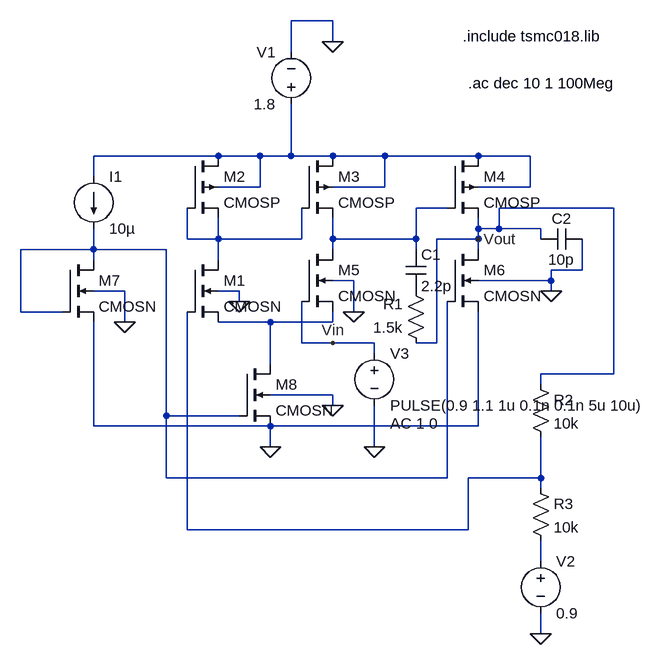
[diagram p0: schematic closed_loop_2-stage_ota.asc]
closed_loop_2-stage_ota.asc, the LTspice schematic file:
Version 4.1
SHEET 1 880 760
WIRE 288 -224 224 -224
WIRE 288 -192 288 -224
WIRE 224 -176 224 -224
WIRE 112 -16 -80 -16
WIRE 176 -16 112 -16
WIRE 224 -16 224 -96
WIRE 224 -16 176 -16
WIRE 288 -16 224 -16
WIRE 368 -16 288 -16
WIRE 512 -16 368 -16
WIRE 592 -16 512 -16
WIRE 288 0 288 -16
WIRE -80 16 -80 -16
WIRE 176 32 176 -16
WIRE 176 32 112 32
WIRE 368 32 368 -16
WIRE 368 32 288 32
WIRE 592 32 592 -16
WIRE 592 32 512 32
WIRE 464 64 416 64
WIRE 720 64 544 64
WIRE 512 96 512 80
WIRE 544 96 544 64
WIRE 544 96 512 96
WIRE 608 96 544 96
WIRE 64 112 64 64
WIRE 112 112 112 80
WIRE 112 112 64 112
WIRE 240 112 240 64
WIRE 240 112 112 112
WIRE 288 112 288 80
WIRE 416 112 416 64
WIRE 416 112 288 112
WIRE 512 112 512 96
WIRE 512 112 448 112
WIRE 608 112 608 96
WIRE -80 128 -80 96
WIRE -80 128 -192 128
WIRE 32 128 -80 128
WIRE 288 128 288 112
WIRE 416 128 416 112
WIRE 512 128 512 112
WIRE -80 144 -80 128
WIRE 112 144 112 112
WIRE 672 160 672 112
WIRE 672 160 624 160
WIRE 320 176 288 176
WIRE 624 176 624 160
WIRE 624 176 512 176
WIRE -32 192 -80 192
WIRE 144 192 112 192
WIRE 624 192 624 176
WIRE 144 208 144 192
WIRE -192 224 -192 128
WIRE -128 224 -192 224
WIRE 320 224 320 176
WIRE -32 240 -32 192
WIRE 192 240 112 240
WIRE 288 240 288 224
WIRE 288 240 192 240
WIRE 240 272 240 208
WIRE 288 272 240 272
WIRE 352 272 288 272
WIRE 448 272 448 112
WIRE 448 272 416 272
WIRE 352 288 352 272
WIRE 192 304 192 240
WIRE 720 320 720 64
WIRE 720 320 608 320
WIRE 608 336 608 320
WIRE 288 352 192 352
WIRE 288 368 288 352
WIRE 32 384 32 128
WIRE 144 384 32 384
WIRE -80 400 -80 240
WIRE 192 400 -80 400
WIRE 512 400 512 224
WIRE 512 400 192 400
WIRE 192 432 192 400
WIRE 352 432 352 368
WIRE 32 480 32 384
WIRE 464 480 464 208
WIRE 464 480 32 480
WIRE 608 480 608 416
WIRE 608 480 496 480
WIRE 608 496 608 480
WIRE 64 560 64 224
WIRE 496 560 496 480
WIRE 496 560 64 560
WIRE 608 608 608 576
WIRE 608 720 608 688
FLAG 192 432 0
FLAG -32 240 0
FLAG 288 368 0
FLAG 320 224 0
FLAG 144 208 0
FLAG 624 192 0
FLAG 288 -192 0
FLAG 512 112 Vout
FLAG 608 720 0
FLAG 352 432 0
FLAG 288 272 Vin
SYMBOL nmos4 64 144 R0
SYMATTR InstName M1
SYMATTR Value CMOSN
SYMATTR Value2 l=0.180u w=5.434u
SYMBOL pmos4 64 -16 R0
SYMATTR InstName M2
SYMATTR Value CMOSP
SYMATTR Value2 l=0.180u w=12.5u
SYMBOL pmos4 240 -16 R0
SYMATTR InstName M3
SYMATTR Value CMOSP
SYMATTR Value2 l=0.18u w=12.5u
SYMBOL pmos4 464 -16 R0
SYMATTR InstName M4
SYMATTR Value CMOSP
SYMATTR Value2 l=0.18u w=56u
SYMBOL nmos4 240 128 R0
SYMATTR InstName M5
SYMATTR Value CMOSN
SYMATTR Value2 l=0.180u w=5.434u
SYMBOL nmos4 464 128 R0
SYMATTR InstName M6
SYMATTR Value CMOSN
SYMATTR Value2 l=0.18u w=19.566u
SYMBOL nmos4 -128 144 R0
SYMATTR InstName M7
SYMATTR Value CMOSN
SYMATTR Value2 l=0.18u w=0.39132u
SYMBOL nmos4 144 304 R0
SYMATTR InstName M8
SYMATTR Value CMOSN
SYMATTR Value2 l=0.180u w=10.86u
SYMBOL current -80 16 R0
WINDOW 123 0 0 Left 0
WINDOW 39 0 0 Left 0
SYMATTR InstName I1
SYMATTR Value 10µ
SYMBOL voltage 224 -80 R180
WINDOW 0 24 96 Left 2
WINDOW 3 24 16 Left 2
WINDOW 123 0 0 Left 0
WINDOW 39 0 0 Left 0
SYMATTR InstName V1
SYMATTR Value 1.8
SYMBOL res 432 288 R180
WINDOW 0 36 76 Left 2
WINDOW 3 36 40 Left 2
SYMATTR InstName R1
SYMATTR Value 1.5k
SYMBOL cap 400 128 R0
SYMATTR InstName C1
SYMATTR Value 2.2p
SYMBOL cap 672 96 R90
WINDOW 0 0 32 VBottom 2
WINDOW 3 32 32 VTop 2
SYMATTR InstName C2
SYMATTR Value 10p
SYMBOL res 592 320 R0
SYMATTR InstName R2
SYMATTR Value 10k
SYMBOL res 592 480 R0
SYMATTR InstName R3
SYMATTR Value 10k
SYMBOL voltage 608 592 R0
WINDOW 123 0 0 Left 0
WINDOW 39 0 0 Left 0
SYMATTR InstName V2
SYMATTR Value 0.9
SYMBOL voltage 352 272 R0
WINDOW 123 24 124 Left 2
WINDOW 39 0 0 Left 0
SYMATTR InstName V3
SYMATTR Value PULSE(0.9 1.1 1u 0.1n 0.1n 5u 10u)
SYMATTR Value2 AC 1 0
TEXT 488 -200 Left 2 !.include tsmc018.lib
TEXT 496 -128 Left 2 !.ac dec 10 1 100Meg

The netlist it stands for:
* closed_loop_2-stage_ota.asc
M1 N003 N006 N005 0 CMOSN l=0.180u w=5.434u
M2 N001 N003 N003 N001 CMOSP l=0.180u w=12.5u
M3 N001 N003 N002 N001 CMOSP l=0.18u w=12.5u
M4 N001 N002 Vout N001 CMOSP l=0.18u w=56u
M5 N002 Vin N005 0 CMOSN l=0.180u w=5.434u
M6 Vout N004 0 0 CMOSN l=0.18u w=19.566u
M7 N004 N004 0 0 CMOSN l=0.18u w=0.39132u
M8 N005 N004 0 0 CMOSN l=0.180u w=10.86u
I1 N001 N004 10µ
V1 N001 0 1.8
R1 Vout P001 1.5k
C1 N002 P001 2.2p
C2 0 Vout 10p
R2 Vout N006 10k
R3 N006 N007 10k
V2 N007 0 0.9
V3 Vin 0 PULSE(0.9 1.1 1u 0.1n 0.1n 5u 10u) AC 1 0
.model NMOS NMOS
.model PMOS PMOS
.lib standard.mos
.include tsmc018.lib
.ac dec 10 1 100Meg
.backanno
.end